# EasyEDA schematic 1-Schematic_ESP-BOX-USB.json
TITLE: ESP-BOX USB; REV: 1.0; Date: 2023-01-27; Sheet: 1/1; Drawn By: espzav; Company: Espressif
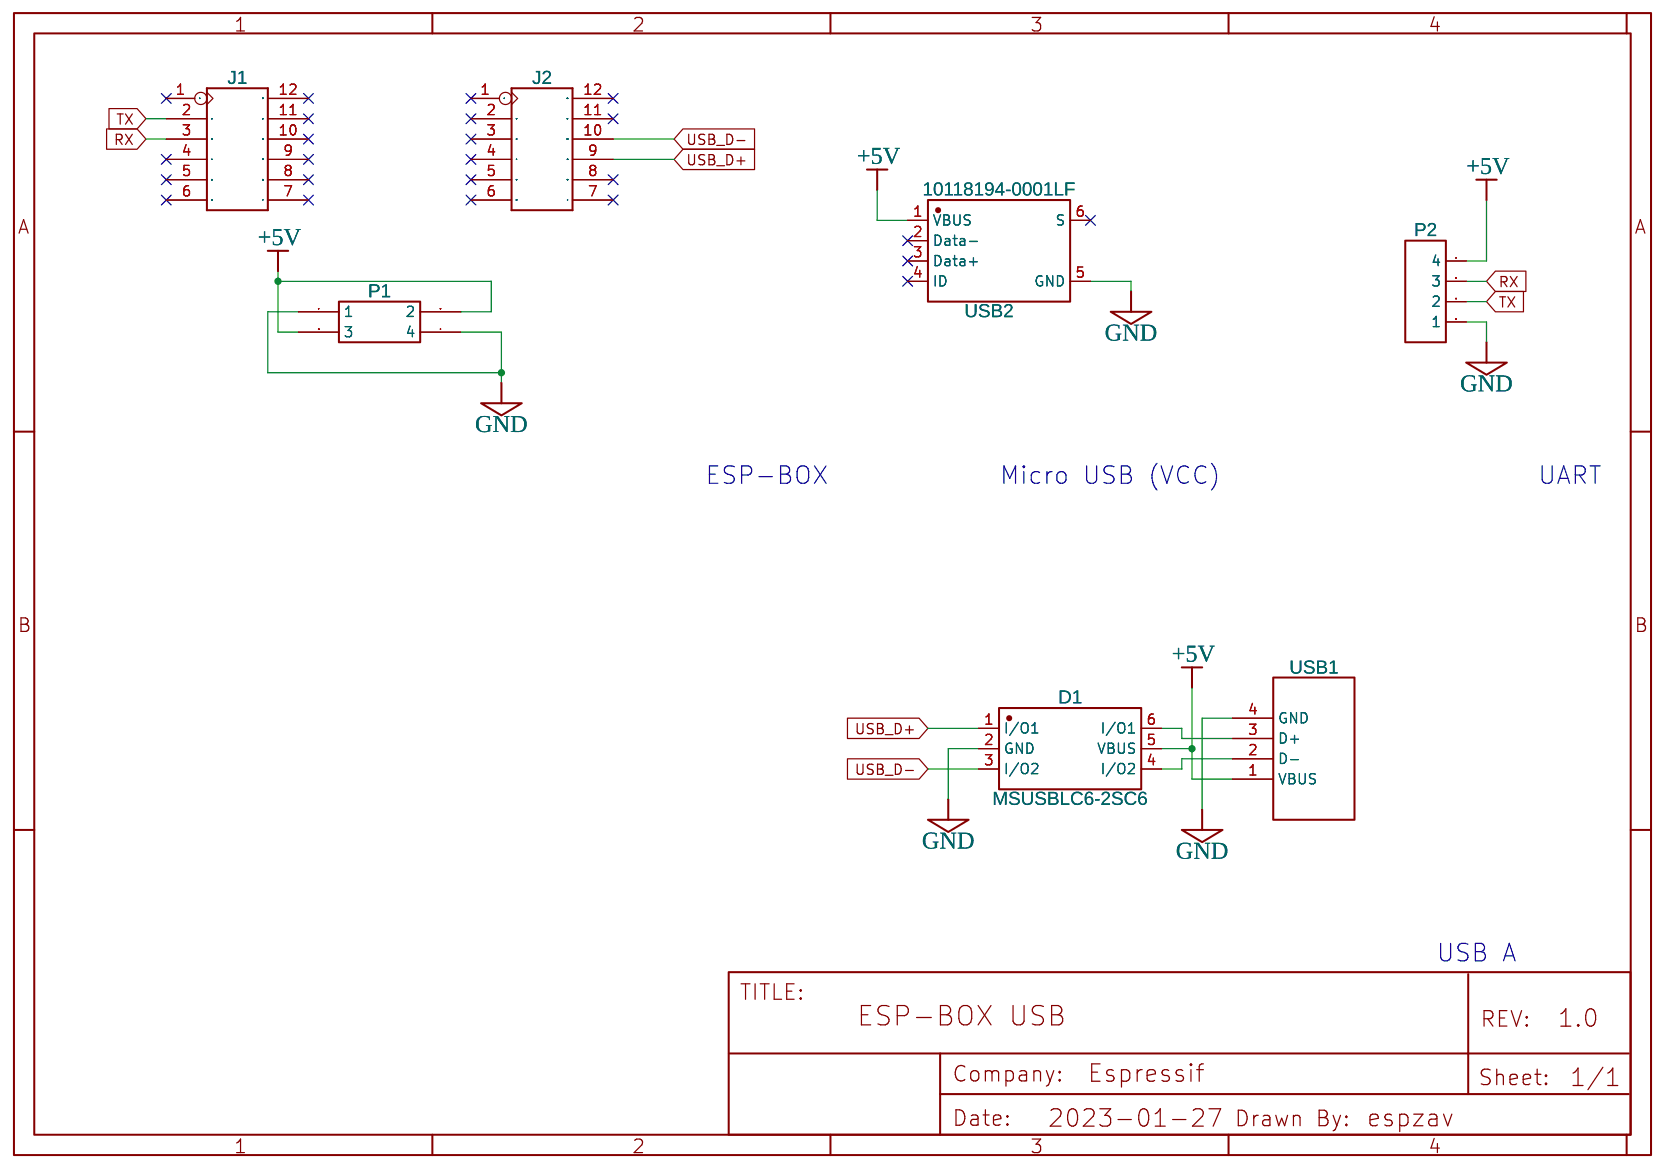
[diagram p0: schematic sheet]

## Parts
D1  MSUSBLC6-2SC6  [SOT-23-6_L2.9-W1.6-P0.95-LS2.8-BL]
J1  P125-1212A0AS116A1  [H2X6-2.54]
J2  P125-1212A0AS116A1  [H2X6-2.54]
P1  Female header/2.54mm2x2 Female header  [HDR-2X2/2.54]
P2  Header-Female-2.54_1x4  [HDR-4X1/2.54]
USB1  USB-A-S-F-B-TH-R USB Type A Connector  [USB-A-S-F-B-TH-R USB TYPE A CONNECTOR]
USB2  10118194-0001LF  [MICRO-USB-SMD_10118194-0001LF]

## Library data of the parts
D1 = MSUSBLC6-2SC6: Supplier: LCSC; Supplier Part: C2830148; Manufacturer: MSKSEMI(美森科); Contributor: lcsc; JLCPCB Part Class: Extended Part
J1 J2 = P125-1212A0AS116A1: DIP Black Male Header;
P1 = Female header/2.54mm2x2 Female header: Supplier Part: undefined; Supplier: LCSC; Manufacturer: ReliaPro
P2 = Header-Female-2.54_1x4: Supplier: LCSC; Manufacturer: ReliaPro; Supplier Part: C124413
USB1 = USB-A-S-F-B-TH-R USB Type A Connector: Manufacturer Part: USB-A-S-F-B-TH-R; Contributor: MWalterman; Supplier Part: SAM10861-ND; Supplier: Digi-Key; link: https://www.digikey.com/product-detail/en/samtec-inc/USB-A-S-F-B-TH-R/SAM10861-ND/2686090
USB2 = 10118194-0001LF: Supplier: LCSC; Supplier Part: C132563; Manufacturer: Amphenol ICC; Contributor: LCSC; JLCPCB Part Class: Extended Part

## Nets
+5V: D1.5(VBUS) P1.2 P1.3 P2.4 USB1.1(VBUS) USB2.1(VBUS)
GND: D1.2(GND) P1.1 P1.4 P2.1 USB1.4(GND) USB2.5(GND)
RX: J1.3 P2.3
TX: J1.2 P2.2
USB_D+: D1.1(I/O1) J2.9
USB_D-: D1.3(I/O2) J2.10
Net-(D1-4): D1.4(I/O2) USB1.2(D-)
Net-(D1-6): D1.6(I/O1) USB1.3(D+)

Not connected (* = marked no-connect by the designer): J1 1* 4* 5* 6* 7* 8* 9* 10* 11* 12*; J2 1* 2* 3* 4* 5* 6* 7* 8* 11* 12*; USB2 2(Data-)* 3(Data+)* 4(ID)* 6(S)*

## Notes on the sheet
- ESP-BOX
- Micro USB (VCC)
- UART
- USB A
